# EAGLE design GabozePocaioPlus (EAGLE 9.0.0)
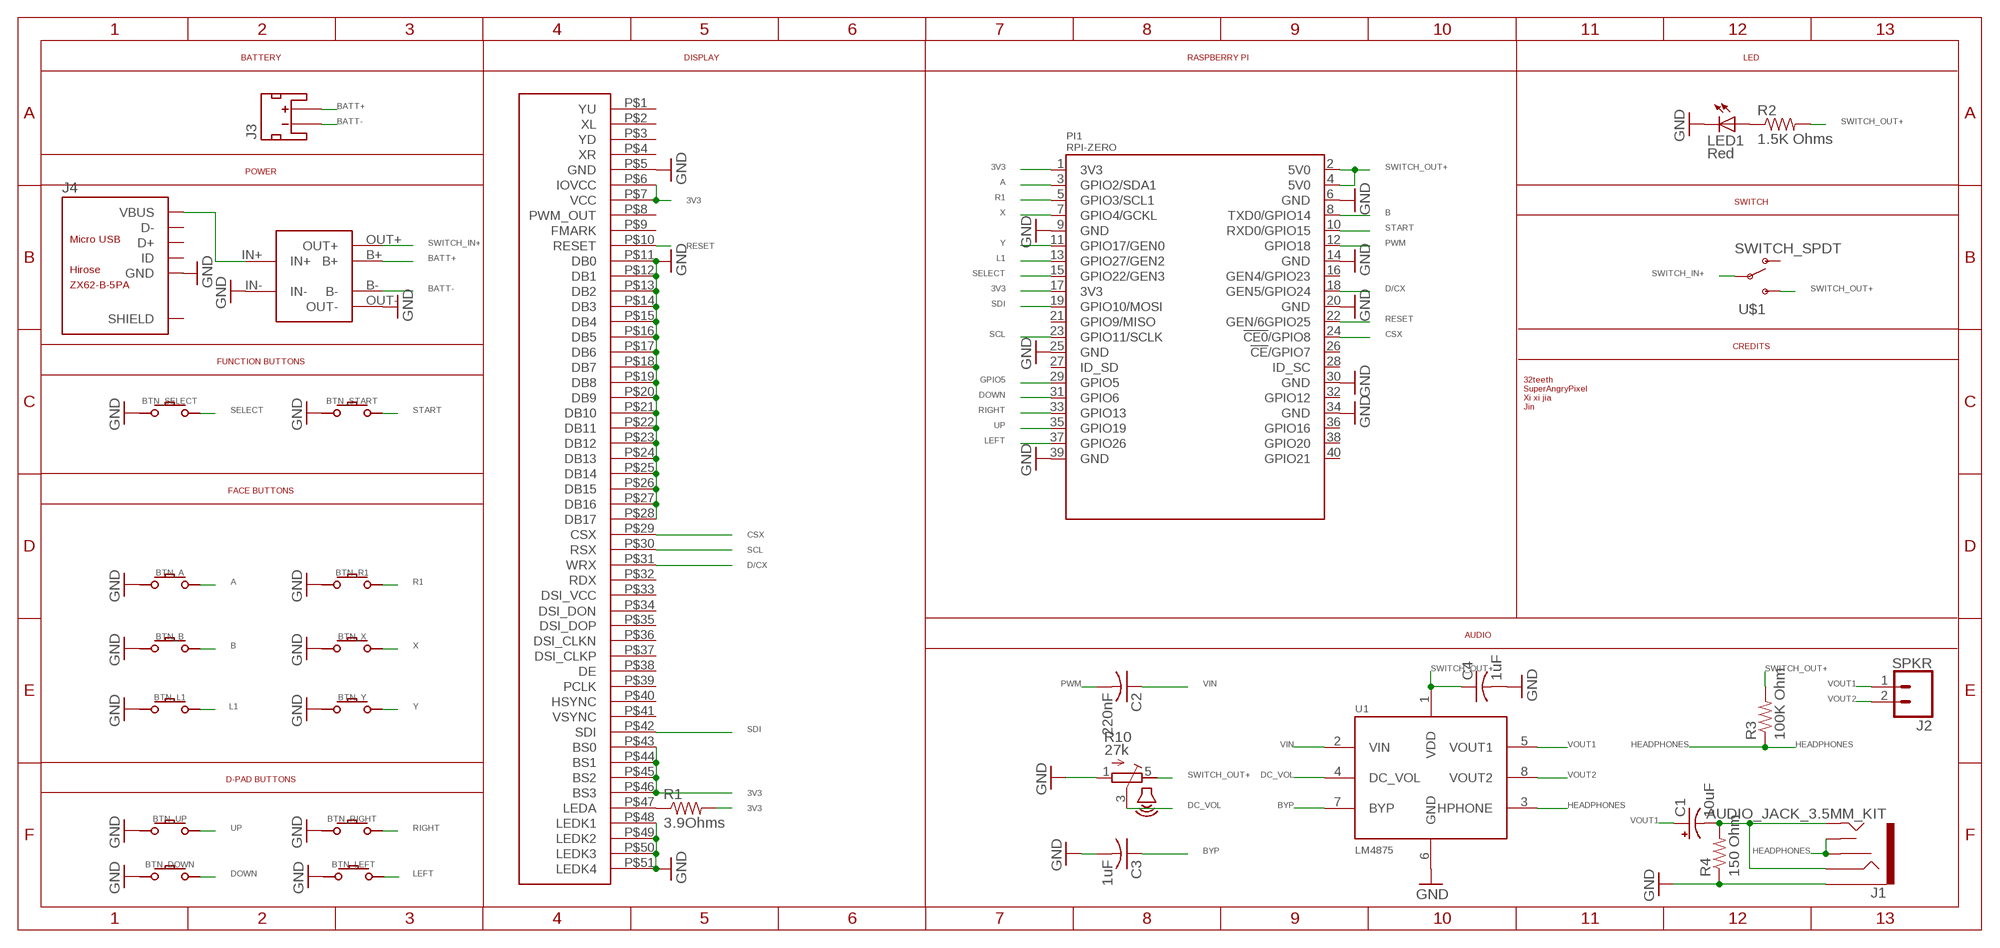
[diagram p0: schematic, sheet 1]

## Parts
BTN_A  CONDUCTIVE_BUTTON  [CONDUCTIVE_BUTTON]
BTN_B  CONDUCTIVE_BUTTON  [CONDUCTIVE_BUTTON]
BTN_DOWN  CONDUCTIVE_BUTTON  [CONDUCTIVE_BUTTON]
BTN_L1  CONDUCTIVE_BUTTON_DRILL  [CONDUCTIVE_BUTTON_DRILL]
BTN_LEFT  CONDUCTIVE_BUTTON  [CONDUCTIVE_BUTTON]
BTN_R1  CONDUCTIVE_BUTTON_DRILL  [CONDUCTIVE_BUTTON_DRILL]
BTN_RIGHT  CONDUCTIVE_BUTTON  [CONDUCTIVE_BUTTON]
BTN_SELECT  CONDUCTIVE_BUTTON_STARTSELECT  [CONDUCTIVE_BUTTON_STARTSELECT]
BTN_START  CONDUCTIVE_BUTTON_STARTSELECT  [CONDUCTIVE_BUTTON_STARTSELECT]
BTN_UP  CONDUCTIVE_BUTTON  [CONDUCTIVE_BUTTON]
BTN_X  CONDUCTIVE_BUTTON_DRILL  [CONDUCTIVE_BUTTON_DRILL]
BTN_Y  CONDUCTIVE_BUTTON_DRILL  [CONDUCTIVE_BUTTON_DRILL]
C1  10uF  10UF-POLAR-EIA3216-16V-10%(TANT)  [EIA3216]
C2  220nF  C-USC0805  [C0805]
C3  1uF  C-USC0805  [C0805]
C4  1uF  C-USC0805  [C0805]
J1  AUDIO_JACK_3.5MM_KIT  [AUDIO-JACK-KIT]
J2  SPKR  CONN_02  [1X02]
J3  Batt Conn  JST_2MM_MALE  [JST-2-SMD]
J4  ZX62-B-5PA  MICRO-USB-SMD(ZX62-B-5PA)  [MICRO-USB5+6P-SMD-0.65-AB]
LED1  Red  LED3MM  [LED3MM]
PI1  RPI-ZERO  [RPI-ZERO]
POWER1  03962A  [03962A]
R1  3.9Ohms  R-US_R0805  [R0805]
R2  1.5K Ohms  R-US_R0805  [R0805]
R3  100K Ohm  R-US_R0805  [R0805]
R4  150 Ohm  R-US_R0805  [R0805]
R10  27k  VOLUME  [VOLUME]
U1  LM4875  [SOIC8]
U$1  SWITCH_SPDT  [KPS-1290]
U$2  TFT-DISPLAY-2.6-51PIN  [TFT-DISPLAY-2.6-51PIN]

## Nets
3V3: PI1.1(3V3) PI1.17(3V3) R1.2 U$2.P$6(IOVCC) U$2.P$7(VCC) U$2.P$43(BS0) U$2.P$44(BS1) U$2.P$45(BS2) U$2.P$46(BS3)
A: BTN_A.P$ACTIVE PI1.3(GPIO2/SDA1)
B: BTN_B.P$ACTIVE PI1.8(TXD0/GPIO14)
BATT+: J3.2(+) POWER1.B+
BATT-: J3.1(-) POWER1.B-
BYP: C3.1 U1.7(BYP)
CSX: PI1.24(!CE0!/GPIO8) U$2.P$29(CSX)
D/CX: PI1.18(GEN5/GPIO24) U$2.P$31(WRX)
DC_VOL: R10.3(S) U1.4(DC_VOL)
DOWN: BTN_DOWN.P$ACTIVE PI1.31(GPIO6)
GND: BTN_A.P$GND BTN_B.P$GND BTN_DOWN.P$GND BTN_L1.P$GND BTN_LEFT.P$GND BTN_R1.P$GND BTN_RIGHT.P$GND BTN_SELECT.P$GND BTN_START.P$GND BTN_UP.P$GND BTN_X.P$GND BTN_Y.P$GND C3.2 C4.2 J1.SLEEVE J4.5(GND) LED1.K(C) PI1.6(GND) PI1.9(GND) PI1.14(GND) PI1.20(GND) PI1.25(GND) PI1.30(GND) PI1.34(GND) PI1.39(GND) POWER1.IN- POWER1.OUT- R4.1 R10.1(A) U1.6(GND) U$2.P$5(GND) U$2.P$11(DB0) U$2.P$12(DB1) U$2.P$13(DB2) U$2.P$14(DB3) U$2.P$15(DB4) U$2.P$16(DB5) U$2.P$17(DB6) U$2.P$18(DB7) U$2.P$19(DB8) U$2.P$20(DB9) U$2.P$21(DB10) U$2.P$22(DB11) U$2.P$23(DB12) U$2.P$24(DB13) U$2.P$25(DB14) U$2.P$26(DB15) U$2.P$27(DB16) U$2.P$28(DB17) U$2.P$48(LEDK1) U$2.P$49(LEDK2) U$2.P$50(LEDK3) U$2.P$51(LEDK4)
GPIO5: PI1.29(GPIO5)
HEADPHONES: J1.RSH J1.TSH R3.1 U1.3(HPHONE)
L1: BTN_L1.P$ACTIVE PI1.13(GPIO27/GEN2)
LED: LED1.A R2.1
LEFT: BTN_LEFT.P$ACTIVE PI1.37(GPIO26)
N$1: R1.1 U$2.P$47(LEDA)
PWM: C2.2 PI1.12(GPIO18)
R1: BTN_R1.P$ACTIVE PI1.5(GPIO3/SCL1)
RESET: PI1.22(GEN/6GPIO25) U$2.P$10(RESET)
RIGHT: BTN_RIGHT.P$ACTIVE PI1.33(GPIO13)
SCL: PI1.23(GPIO11/SCLK) U$2.P$30(RSX)
SDI: PI1.19(GPIO10/MOSI) U$2.P$42(SDI)
SELECT: BTN_SELECT.P$ACTIVE PI1.15(GPIO22/GEN3)
START: BTN_START.P$ACTIVE PI1.10(RXD0/GPIO15)
SWITCH_IN+: POWER1.OUT+ U$1.P
SWITCH_OUT+: C4.1 PI1.2(5V0) PI1.4(5V0) R2.2 R3.2 R10.5(E) U1.1(VDD) U$1.S
UP: BTN_UP.P$ACTIVE PI1.35(GPIO19)
VIN: C2.1 U1.2(VIN)
VIN1: C1.- J1.RING J1.TIP R4.2
VOUT1: C1.+ J2.1 U1.5(VOUT1)
VOUT2: J2.2 U1.8(VOUT2)
VUSB: J4.1(VBUS) POWER1.IN+
X: BTN_X.P$ACTIVE PI1.7(GPIO4/GCKL)
Y: BTN_Y.P$ACTIVE PI1.11(GPIO17/GEN0)
Unconnected: J3.NC1(PAD1) J3.NC2(PAD2) J4.2(D-) J4.3(D+) J4.4(ID) J4.P1(SHIELD) J4.P2(SHIELD) J4.P3(SHIELD) J4.P4(SHIELD) J4.P5(SHIELD) J4.P6(SHIELD) PI1.16(GEN4/GPIO23) PI1.21(GPIO9/MISO) PI1.26(!CE!/GPIO7) PI1.27(ID_SD) PI1.28(ID_SC) PI1.32(GPIO12) PI1.36(GPIO16) PI1.38(GPIO20) PI1.40(GPIO21) U$1.O U$2.P$1(YU) U$2.P$2(XL) U$2.P$3(YD) U$2.P$4(XR) U$2.P$8(PWM_OUT) U$2.P$9(FMARK) U$2.P$32(RDX) U$2.P$33(DSI_VCC) U$2.P$34(DSI_DON) U$2.P$35(DSI_DOP) U$2.P$36(DSI_CLKN) U$2.P$37(DSI_CLKP) U$2.P$38(DE) U$2.P$39(PCLK) U$2.P$40(HSYNC) U$2.P$41(VSYNC)

## Notes on the sheet
- BATTERY | DISPLAY | RASPBERRY PI | LED
- POWER
- SWITCH
- CREDITS
- FUNCTION BUTTONS
- 32teeth
  SuperAngryPixel
  Xi xi jia
  Jin
- FACE BUTTONS
- AUDIO
- D-PAD BUTTONS

## Library data of the parts
BTN_A BTN_B BTN_DOWN BTN_LEFT BTN_RIGHT BTN_UP = 32teeth - Conductive Buttons:CONDUCTIVE_BUTTON
BTN_L1 = ConductiveButtons:CONDUCTIVE_BUTTON_DRILL
BTN_R1 BTN_X BTN_Y = 32teeth - Conductive Buttons:CONDUCTIVE_BUTTON_DRILL
BTN_SELECT BTN_START = 32teeth - Conductive Buttons:CONDUCTIVE_BUTTON_STARTSELECT
C1 = SparkFun-Capacitors:10UF-POLAR: 10.0µF polarized capacitors A capacitor is a passive two-terminal electrical component used to store electrical energy temporarily in an electric field.; PROD_ID: CAP-00811
C2-C4 = adafruit:C-US: CAPACITOR, American symbol
J1 = SparkFun-Connectors:AUDIO_JACK_3.5MM: Audio Jack 3.5mm variants of PTH and SMT stereo audio jack with bypass switches. SparkFun Products: SparkFun SparkPunk Sound Kit <[https://www.sparkfun.com/products/11177]> - PTH MP3 Trigger <https://www.sparkfun.com/products/13720> -3.5mm SMD SparkFun PicoBoard <https://www.sparkfun.com/products/11888>- 2.5mm SMD; PROD_ID: CONN-08774; SF_ID: PRT-08032
J2 = SparkFun-Connectors:CONN_02: Multi connection point. Often used as Generic Header-pin footprint for 0.1 inch spaced/style header connections On any of the 0.1 inch spaced packages, you can populate with these: Break Away Headers - Straight <https://www.sparkfun.com/products/116> (PRT-00116) Break Away Male Headers - Right Angle <https://www.sparkfun.com/products/553> (PRT-00553) Female Headers <https://www.sparkfun.com/products/115> (PRT-00115) Break Away Headers - Machine Pin <https://www.sparkfun.com/products/117> (PRT-00117) Break Away Female Headers - Swiss Machine Pin <https://www.sparkfun.com/products/743> (PRT-00743) For SCREWTERMINALS and SPRING TERMINALS visit here: Screw Terimnals on SparkFun.com <https://www.sparkfun.com/search/results?term=Screw+Terminals> (5mm/3.5mm/2.54mm spacing) This device is also useful as a general connection point to wire up your design to another part of your project. Our various solder wires solder well into these plated through hole pads. Hook-Up Wire - Assortment (Stranded, 22 AWG) <https://www.sparkfun.com/products/11375> (PRT-11375) Hook-Up Wire - Assortment (Solid Core, 22 AWG) <https://www.sparkfun.com/products/11367> (PRT-11367) View the entire wire category on our website here <https://www.sparkfun.com/categories/141> Special notes: Molex polarized connector foot print use with: PRT-08233 with associated crimp pins and housings. 2.54_SCREWTERM for use with PRT-10571. 3.5mm Screw Terminal footprints for PRT-08084 5mm Screw Terminal footprints for use with PRT-08432
J3 = SparkFun-Connectors:JST_2MM_MALE: Mates to single-cell LiPo batteries. CONN-11443 Now with smashable polarity marks!; BTM_NEG: -; BTM_POS: +; PROD_ID: CONN-11443; TOP_NEG: -; TOP_POS: +
J4 = Seeed-Connector:MICRO-USB-SMD(ZX62-B-5PA): 320010005; MPN: ZX62-B-5PA
LED1 = adafruit:LED: LED OSRAM: - CHIPLED LG R971, LG N971, LY N971, LG Q971, LY Q971, LO R971, LY R971 LH N974, LH R974 LS Q976, LO Q976, LY Q976 LO Q996 - Hyper CHIPLED LW Q18S LB Q993, LB Q99A, LB R99A - SideLED LS A670, LO A670, LY A670, LG A670, LP A670 LB A673, LV A673, LT A673, LW A673 LH A674 LY A675 LS A676, LA A676, LO A676, LY A676, LW A676 LS A679, LY A679, LG A679 - Hyper Micro SIDELED® LS Y876, LA Y876, LO Y876, LY Y876 LT Y87S - SmartLED LW L88C, LW L88S LB L89C, LB L89S, LG L890 LS L89K, LO L89K, LY L89K LS L896, LA L896, LO L896, LY L896 - TOPLED LS T670, LO T670, LY T670, LG T670, LP T670 LSG T670, LSP T670, LSY T670, LOP T670, LYG T670 LG T671, LOG T671, LSG T671 LB T673, LV T673, LT T673, LW T673 LH T674 LS T676, LA T676, LO T676, LY T676, LB T676, LH T676, LSB T676, LW T676 LB T67C, LV T67C, LT T67C, LS T67K, LO T67K, LY T67K, LW E67C LS E67B, LA E67B, LO E67B, LY E67B, LB E67C, LV E67C, LT E67C LW T67C LS T679, LY T679, LG T679 LS T770, LO T770, LY T770, LG T770, LP T770 LB T773, LV T773, LT T773, LW T773 LH T774 LS E675, LA E675, LY E675, LS T675 LS T776, LA T776, LO T776, LY T776, LB T776 LHGB T686 LT T68C, LB T68C - Hyper Mini TOPLED® LB M676 - Mini TOPLED Santana® LG M470 LS M47K, LO M47K, LY M47K Source: http://www.osram.convergy.de/
PI1 = 32teeth - Gaboze-Pi:RPI-ZERO
POWER1 = 03962A:03962A
R1-R4 = adafruit:R-US_: RESISTOR, American symbol
R10 = GBA:VOLUME
U1 = texas:LM4875
U$1 = SparkFun-Retired:SWITCH_SPDT: SWCH-10651 Side-actuated SPDT slide switch, as used on the Arduino Pro; PROD_ID: SWCH-10651
U$2 = 32teeth - 2.6" TFT 51P:TFT-DISPLAY-2.6-51PIN: ILI9342 51P 2.6" TFT LCD

## Board
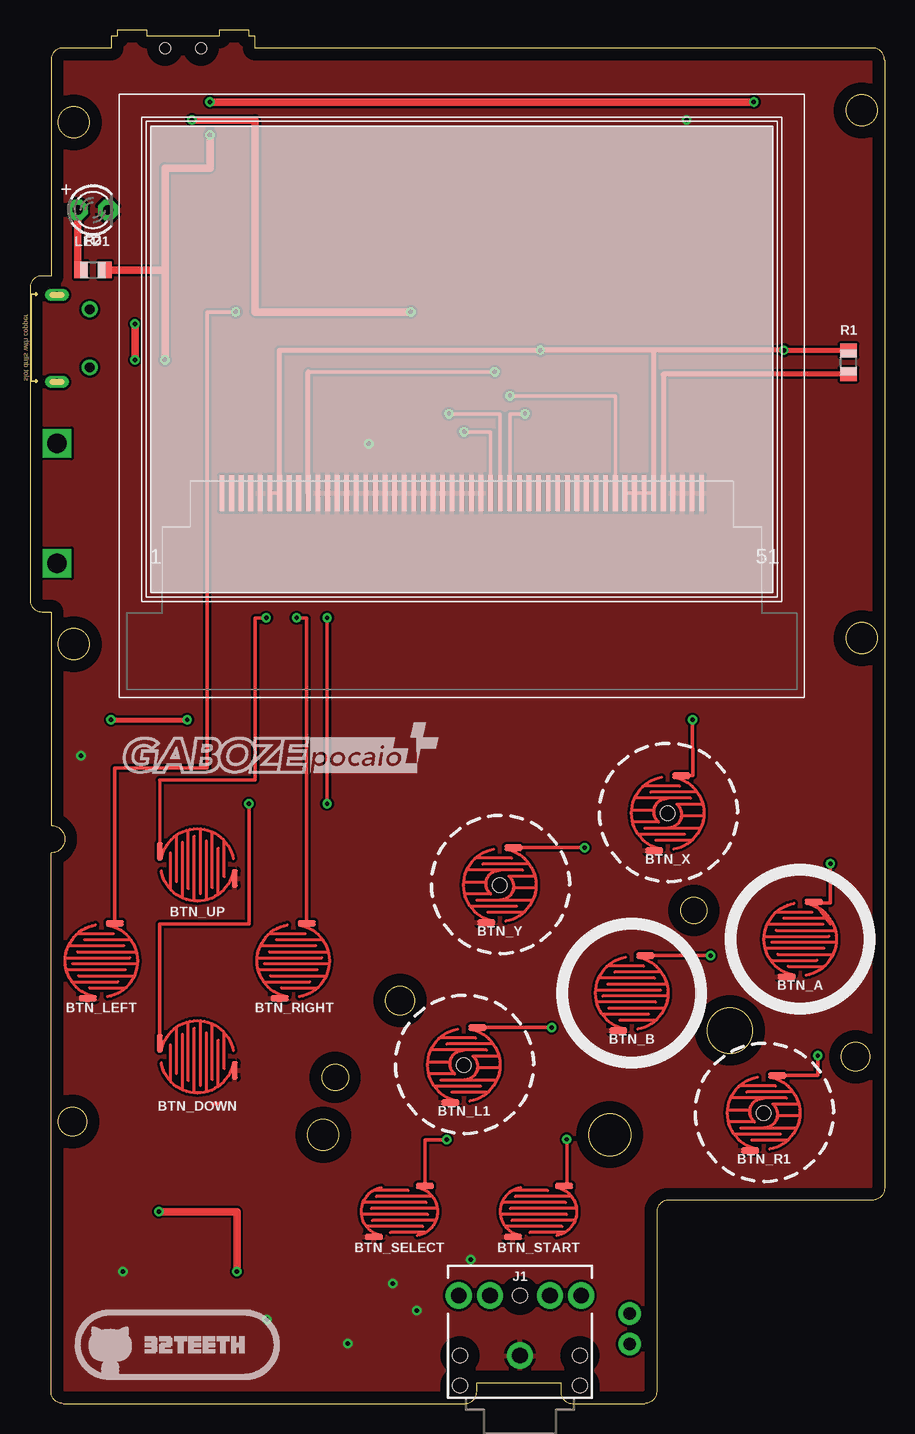
[diagram p1: board, top side]
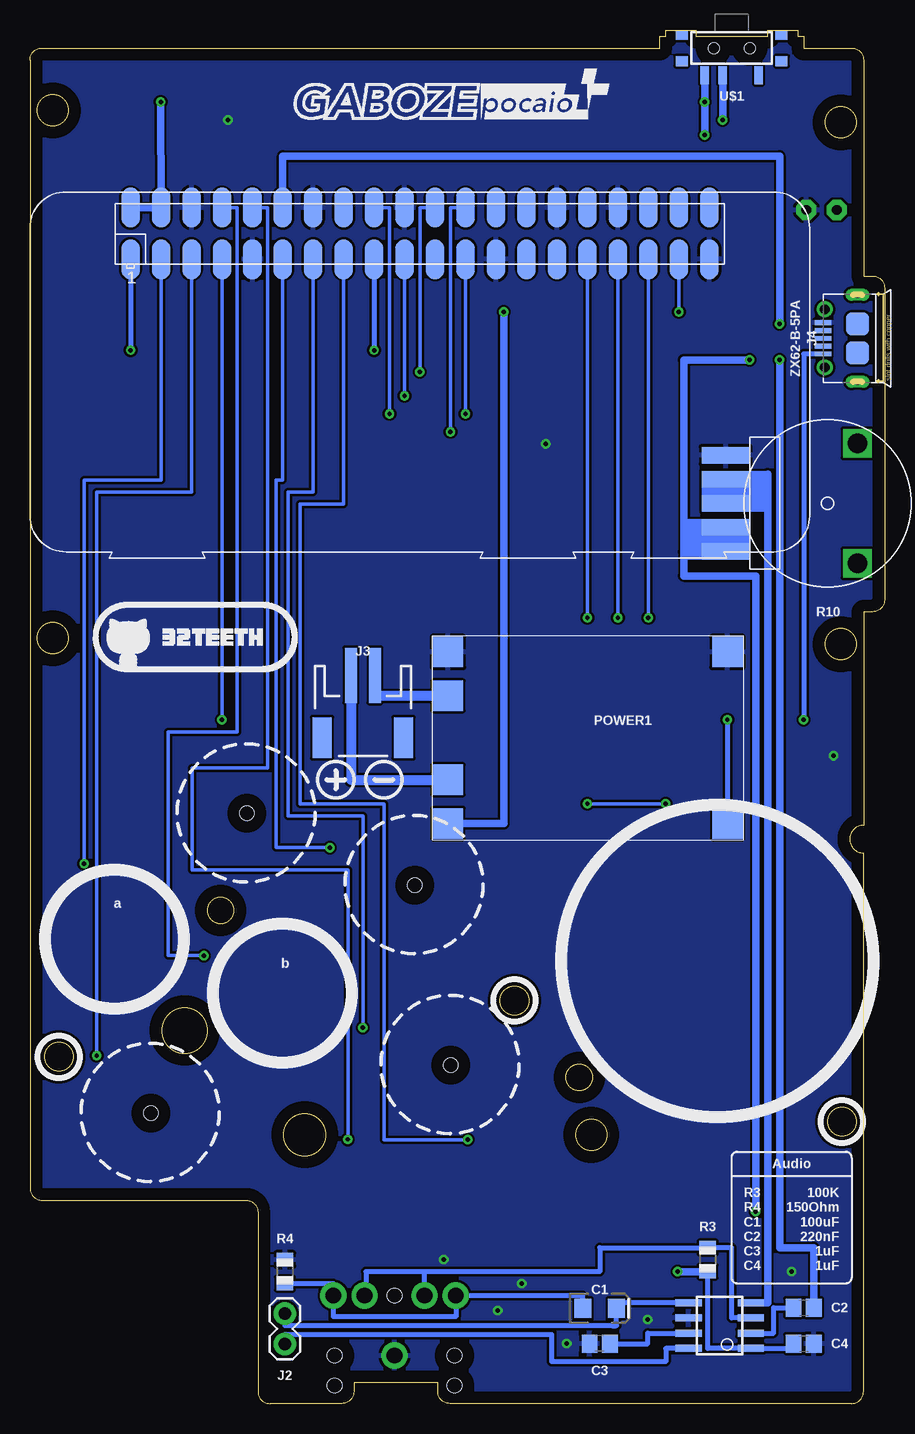
[diagram p2: board, bottom side, seen from below]

Size 71.25 x 114.5 mm. Coordinates in mm from the lower left corner, seen from the top.
Outline: 71.25,112 71.25,17.95 arc-90 70.25,16.95 53.25,16.95 arc90 52.25,15.95 52.25,1 arc-90 51.25,0 45.25,0 arc-90 44.25,1 44.25,1.75 37.25,1.75 37.25,1 arc-90 36.25,0 2.75,0 arc-90 1.75,1 1.75,45.9 arc180 1.75,48.2 1.75,66 1,66 arc-90 0,67 0,93 arc-90 1,94 1.75,94 1.75,112 arc-90 2.75,113 6.75,113 6.75,114 7.25,114 7.25,114.5 9.75,114.5 9.75,114 15.75,114 15.75,114.5 18.25,114.5 18.25,114 18.75,114 18.75,113 70.25,113 arc-90 71.25,112
Outline: circle at 3.55,23.5 radius 1.2
Outline: circle at 68.85,28.9 radius 1.2
Outline: circle at 58.35,31.1 radius 1.9
Outline: circle at 48.35,22.4 radius 1.75
Outline: circle at 30.85,33.6 radius 1.2
Outline: circle at 25.45,27.2 radius 1.1
Outline: circle at 24.45,22.4 radius 1.3
Outline: circle at 55.35,41.1 radius 1.1
Outline: circle at 69.35,107.8 radius 1.3
Outline: circle at 3.65,106.8 radius 1.3
Outline: circle at 69.35,63.8 radius 1.3
Outline: circle at 3.65,63.3 radius 1.3
Copper layers (1*16): Top 0.035mm / dielectric 1.5mm / Bottom 0.035mm
Design rules "default *": minimum track width 10mil, minimum drill 24mil, track to track 8mil, track to pad 8mil, pad to pad 8mil, via to via 8mil, smd to smd 8mil, copper to edge 40mil, drill to drill 8mil, minimum pad ring 10mil, minimum via ring 8mil, stop-mask expansion 5mil, vias tented up to drill 10mil, thermal gap 10mil

### Footprints (pad centres in the part's own frame; a part is rotated, then mirrored left to right if it is on the bottom)
CONDUCTIVE_BUTTON = smd 1.5 x 0.508: P$ACTIVE 1.125,3.125; P$GND -1.125,-3.125
CONDUCTIVE_BUTTON_DRILL = smd 1.5 x 0.508: P$ACTIVE 1.125,3.125; P$GND -1.125,-3.125 | hole 1.2: 0,0
CONDUCTIVE_BUTTON_STARTSELECT = smd 1.5 x 0.508: P$ACTIVE 2.125,2.125; P$GND -2.125,-2.125
EIA3216 = smd 1.4 x 1.6: + 1.4,0; - -1.4,0
C0805 = smd 1.3 x 1.5: 1 -0.85,0; 2 0.85,0
AUDIO-JACK-KIT = drill 1.3 pad 2.184: RING 5,5.1; RSH 5,2.5; SLEEVE 0,0; TIP 5,-5.1; TSH 5,-2.5 | hole 1.2: 0,5; -2.5,5; -2.5,-5; 0,-5; 5,0
1X02 = drill 1.016 pad 1.88: 1 0,0; 2 2.54,0
JST-2-SMD = smd 1 x 4.6: 1 -1,-3.7; 2 1,-3.7 | smd 1.6 x 3.4: NC1 -3.4,1.5; NC2 3.4,1.5
MICRO-USB5+6P-SMD-0.65-AB = smd 0.4 x 1.35: 1 -1.3,2.875; 2 -0.65,2.875; 3 0,2.875; 4 0.65,2.875; 5 1.3,2.875 | smd 1.9 x 1.9: P1 -1.2,0; P2 1.2,0 | drill 0.508 pad 1.016 long: P3 -3.625,0; P4 3.625,0 | drill 0.8: P5 -2.425,2.73; P6 2.425,2.73
LED3MM = drill 0.813 pad 1.676 octagon: A -1.27,0; K 1.27,0
RPI-ZERO = smd 1.524 x 3.302: 1 8.382,24.384; 2 8.382,28.702; 3 10.922,24.384; 4 10.922,28.702; 5 13.462,24.384; 6 13.462,28.702; 7 16.002,24.384; 8 16.002,28.702; 9 18.542,24.384; 10 18.542,28.702; 11 21.082,24.384; 12 21.082,28.702; 13 23.622,24.384; 14 23.622,28.702; 15 26.162,24.384; 16 26.162,28.702; 17 28.702,24.384; 18 28.702,28.702; 19 31.242,24.384; 20 31.242,28.702; 21 33.782,24.384; 22 33.782,28.702; 23 36.322,24.384; 24 36.322,28.702; 25 38.862,24.384; 26 38.862,28.702; 27 41.402,24.384; 28 41.402,28.702; 29 43.942,24.384; 30 43.942,28.702; 31 46.482,24.384; 32 46.482,28.702; 33 49.022,24.384; 34 49.022,28.702; 35 51.562,24.384; 36 51.562,28.702; 37 54.102,24.384; 38 54.102,28.702; 39 56.642,24.384; 40 56.642,28.702
03962A = smd 2.54 x 2.54: B+ 12,1.35; B- 5,1.35; IN+ 15.65,24.65; IN- 1.35,24.65; OUT+ 15.65,1.35; OUT- 1.35,1.35
R0805 = smd 1.1 x 1.4: 1 -1,0; 2 1,0
VOLUME = smd 1.4 x 4: 1 -4,-2; 2 -2,-2; 3 0,-2; 4 2,-2; 5 4,-2 | drill 1.6 square: P$6 -5,9; P$7 5,9
SOIC8 = smd 0.6 x 2.2: 1 -1.905,-2.6; 2 -0.635,-2.6; 3 0.635,-2.6; 4 1.905,-2.6; 5 1.905,2.6; 6 0.635,2.6; 7 -0.635,2.6; 8 -1.905,2.6
KPS-1290 = smd 0.7 x 1.5: O -2.25,2.25; P 0.75,2.25; S 2.25,2.25 | smd 1 x 0.8: P$1 -4.15,1.1; P$2 -4.15,-1.1; P$3 4.15,-1.1; P$4 4.15,1.1 | hole 0.9: -1.5,0; 1.5,0
TFT-DISPLAY-2.6-51PIN = smd 0.4 x 3: P$1 -20,-8.12; P$2 -19.2,-8.12; P$3 -18.4,-8.12; P$4 -17.6,-8.12; P$5 -16.8,-8.12; P$6 -16,-8.12; P$7 -15.2,-8.12; P$8 -14.4,-8.12; P$9 -13.6,-8.12; P$10 -12.8,-8.12; P$11 -12,-8.12; P$12 -11.2,-8.12; P$13 -10.4,-8.12; P$14 -9.6,-8.12; P$15 -8.8,-8.12; P$16 -8,-8.12; P$17 -7.2,-8.12; P$18 -6.4,-8.12; P$19 -5.6,-8.12; P$20 -4.8,-8.12; P$21 -4,-8.12; P$22 -3.2,-8.12; P$23 -2.4,-8.12; P$24 -1.6,-8.12; P$25 -0.8,-8.12; P$26 0,-8.12; P$27 0.8,-8.12; P$28 1.6,-8.12; P$29 2.4,-8.12; P$30 3.2,-8.12; P$31 4,-8.12; P$32 4.8,-8.12; P$33 5.6,-8.12; P$34 6.4,-8.12; P$35 7.2,-8.12; P$36 8,-8.12; P$37 8.8,-8.12; P$38 9.6,-8.12; P$39 10.4,-8.12; P$40 11.2,-8.12; P$41 12,-8.12; P$42 12.8,-8.12; P$43 13.6,-8.12; P$44 14.4,-8.12; P$45 15.2,-8.12; P$46 16,-8.12; P$47 16.8,-8.12; P$48 17.6,-8.12; P$49 18.4,-8.12; P$50 19.2,-8.12; P$51 20,-8.12

### Placement (x,y rotation side)
BTN_A  64.22,38.7 0 top
BTN_B  50.17,34.21 0 top
BTN_DOWN  13.95,28.9 90 top
BTN_L1  36.17,28.21 0 top
BTN_LEFT  5.95,36.9 0 top
BTN_R1  61.17,24.21 0 top
BTN_RIGHT  21.95,36.9 0 top
BTN_SELECT  30.8,16.01 0 top
BTN_START  42.41,16.01 0 top
BTN_UP  13.95,44.9 90 top
BTN_X  53.17,49.21 0 top
BTN_Y  39.17,43.21 0 top
C1  23.75,7.95 0 bottom
C2  6.75,8 0 bottom
C3  23.75,5 180 bottom
C4  6.75,5 0 bottom
J1  40.85,4 90 top
J2  50,7.5 270 bottom
J3  43.5,57 180 bottom
J4  2.25,88.8 90 bottom
LED1  5.25,99.5 0 top
PI1  71.25,71 0 bottom
POWER1  37.75,64 270 bottom
R1  68.25,86.8 90 top
R2  5.25,94.5 0 top
R3  14.75,12 270 bottom
R4  50,11 270 bottom
R10  11.25,75.05 270 bottom
U1  13.75,6.5 90 bottom
U$1  12.75,113 180 bottom
U$2  36,84 0 top

### Tracks (layer width: path | path; a pad name or v marks a point on that pad's centre or on a via)
3V3  (via drill 0.35)
  Top 0.305: U$2.P$7 U$2.P$6 | U$2.P$43 U$2.P$44 U$2.P$45 U$2.P$46
  Top 0.406: 52,87.8 v62.87,87.8 R1.2 | 52,87.8 v42.55,87.8 20.8,87.8 U$2.P$7 | U$2.P$46 52,87.8
  Bottom 0.406: PI1.1 v62.87,87.8 | PI1.17 v42.55,87.8
A  (via drill 0.35)
  Top 0.254: 66.75,39.95 65.41,41.74 BTN_A.P$ACTIVE
  Top 0.305: v66.75,45 66.75,41.74 65.41,41.74
  Bottom 0.305: PI1.3 60.33,77 66.75,77 v66.75,45
B  (via drill 0.35)
  Top 0.305: BTN_B.P$ACTIVE v56.75,37.34
  Bottom 0.305: PI1.8 53.98,99.7 53.98,56 59.75,56 59.75,37.34 v56.75,37.34
BATT+
  Bottom 0.813: J3.2 44.5,52 POWER1.B+
BATT-
  Bottom 0.813: POWER1.B- 42.5,59 J3.1
BYP
  Bottom 0.406: C3.1 19.75,5 19.75,5.87 U1.7
CSX  (via drill 0.35)
  Top 0.305: U$2.P$29 38.4,81 v36.2,81
  Bottom 0.305: PI1.24 36.2,99.7 v36.2,81
D/CX  (via drill 0.35)
  Top 0.305: U$2.P$31 40,82.5 v41.27,82.5
  Bottom 0.305: PI1.18 41.27,99.7 v41.27,82.5
DC_VOL
  Bottom 0.61: U1.4 9.75,8.4 9.75,75 | 9.75,75 9.75,77.5 | R10.3 9.8,75.05 9.75,75
DOWN  (via drill 0.35)
  Top 0.305: v24.78,65.5 v24.78,50 | v18.25,50 18.25,40 10.82,40 BTN_DOWN.P$ACTIVE
  Bottom 0.305: v18.25,50 v24.78,50 | PI1.31 v24.78,65.5
GND  (via drill 0.35)
  Top 0.305: 15.2,25 15.75,25
  other vias: 36.75,12 30.25,10 32.25,7.75 7.75,11 54.75,107 26.5,5 19.75,7 4.25,54 28.25,80
  pour Top: 1.75,0 37.25,0 37.25,1.75 44.25,1.75 44.25,0 52.25,0 52.25,16.95 71.25,16.95 71.25,113 18.75,113 18.75,114 18.25,114 18.25,114.5 15.75,114.5 15.75,114 9.75,114 9.75,114.5 7.25,114.5 7.25,114 6.75,114 6.75,113 1.75,113 1.75,94 0,94 0,66 1.75,66
  pour Bottom: 1.75,0 37.25,0 37.25,1.75 44.25,1.75 44.25,0 52.25,0 52.25,16.95 71.25,16.95 71.25,113 18.75,113 18.75,114 18.25,114 18.25,114.5 15.75,114.5 15.75,114 9.75,114 9.75,114.5 7.25,114.5 7.25,114 6.75,114 6.75,113 1.75,113 1.75,94 0,94 0,66 1.75,66
HEADPHONES
  Bottom 0.406: 38.35,11 23.75,11 23.75,13 R3.1 12.75,13 12.75,7.13 U1.3 | 38.35,11 43.25,11 43.25,9 J1.TSH | J1.RSH 38.35,11
L1  (via drill 0.35)
  Top 0.305: v43.5,31.34 BTN_L1.P$ACTIVE
  Bottom 0.305: PI1.13 47.63,76 49.75,76 49.75,49 43.5,49 v43.5,31.34
LED
  Top 0.61: LED1.A 3.98,94.5 R2.1
LEFT  (via drill 0.35)
  Top 0.305: v17.16,91 14.75,91 14.75,53 7.08,53 BTN_LEFT.P$ACTIVE
  Bottom 0.305: PI1.37 v17.16,91
N$1
  Top 0.406: R1.1 52.8,85.8 U$2.P$47
PWM  (via drill 0.35)
  Top 0.61: v8.75,90 v8.75,87
  Bottom 0.61: PI1.12 50.18,104 8.75,104 v8.75,90 | v8.75,87 8.75,13 5.9,13 C2.2
R1  (via drill 0.35)
  Top 0.305: v65.69,29 65.69,27.34 BTN_R1.P$ACTIVE
  Bottom 0.305: v65.69,29 65.69,76 57.79,76 PI1.5
RESET  (via drill 0.35)
  Top 0.305: 23.2,86 v38.75,86
  Top 0.406: U$2.P$10 23.2,86
  Bottom 0.305: PI1.22 38.75,99.7 v38.75,86
RIGHT  (via drill 0.35)
  Top 0.305: v22.24,65.5 23.07,65.5 BTN_RIGHT.P$ACTIVE
  Bottom 0.305: v22.24,65.5 PI1.33
SCL  (via drill 0.35)
  Top 0.305: U$2.P$30 39.2,82.5 v34.93,82.5
  Bottom 0.305: v34.93,82.5 PI1.23
SDI  (via drill 0.35)
  Top 0.305: U$2.P$42 48.8,84 v40.02,84
  Bottom 0.305: v40.02,84 PI1.19
SELECT  (via drill 0.35)
  Top 0.305: v34.75,22 32.93,22 BTN_SELECT.P$ACTIVE
  Bottom 0.305: v34.75,22 41.75,22 41.75,50 48.75,50 48.75,75 45.09,75 PI1.15
START  (via drill 0.35)
  Top 0.254: 44.75,18.14 BTN_START.P$ACTIVE
  Top 0.305: v44.75,22.01 44.75,18.14
  Bottom 0.305: PI1.10 51.44,99.7 51.44,53 57.75,53 57.75,44.5 44.75,44.5 v44.75,22.01
SWITCH_IN+  (via drill 0.35)
  Top 0.61: v13.5,107 18.75,107 18.75,91 v31.75,91
  Bottom 0.61: POWER1.OUT+ 31.75,48.35 v31.75,91 | U$1.P v13.5,107
SWITCH_OUT+  (via drill 0.35)
  Top 0.61: v15,108.5 v60.34,108.5 | v15,105.75 15,103 11.25,103 11.25,94.5 | v11.25,87 11.25,94.5 | v17.25,11 17.25,16 v10.75,16 | R2.2 11.25,94.5
  Bottom 0.254: 7.6,4.59 C4.1
  Bottom 0.406: R3.2 14.75,4.59 U1.1 7.6,4.59
  Bottom 0.61: PI1.2 PI1.4 v60.34,108.5 | v15,105.75 v15,108.5 U$1.S | R3.2 v17.25,11 | v11.25,87 16.75,87 16.75,71 | 16.75,71 16.75,69 10.75,69 v10.75,16 | R10.5 16.7,71.05 16.75,71
UP  (via drill 0.35)
  Top 0.254: 10.82,52 BTN_UP.P$ACTIVE
  Top 0.305: v19.7,65.5 18.75,65.5 18.75,52 10.82,52
  Bottom 0.305: PI1.35 v19.7,65.5
VIN
  Bottom 0.406: U1.2 9.25,5.87 9.25,8 C2.1
VIN1
  Bottom 0.406: R4.2 45.95,10 J1.TIP 45.95,7.25 35.75,7.25 J1.RING 25.15,9 C1.-
VOUT1
  Bottom 0.254: 22.9,8.4 C1.+ | 22.35,6.5 22.75,6.5
  Bottom 0.406: J2.1 50,6.5 22.75,6.5 22.35,6.5 C1.+ 22.35,8.4 U1.5
VOUT2
  Bottom 0.406: U1.8 18.25,4.59 18.25,3.5 27.75,3.5 27.75,5.75 50,5.75 J2.2
VUSB  (via drill 0.35)
  Top 0.406: v6.75,57 v13.1,57
  Bottom 0.406: J4.1 6.75,87.5 v6.75,57 | v13.1,57 POWER1.IN+
X  (via drill 0.35)
  Top 0.305: v55.25,57 55.26,52.34 BTN_X.P$ACTIVE
  Bottom 0.305: PI1.7 v55.25,57
Y  (via drill 0.35)
  Top 0.305: v46.25,46.34 BTN_Y.P$ACTIVE
  Bottom 0.305: PI1.11 50.17,77 50.75,77 50.75,46.34 v46.25,46.34
(copper drawn outside any net)
  shapes: Bottom area x2

### Text on the board
bPlace: a | b | Audio | 100K / 150Ohm / 100uF / 220nF / 1uF / 1uF | R3 / R4 / C1 / C2 / C3 / C4 | R3 | R4 | C1 | C2 | C4 | C3
200bmp: 32teeth | 32teeth | 32teeth | 32teeth